# Altium schematic sheet Schematic.SchDoc
size A4; SheetNumber: 1; SheetTotal: 1
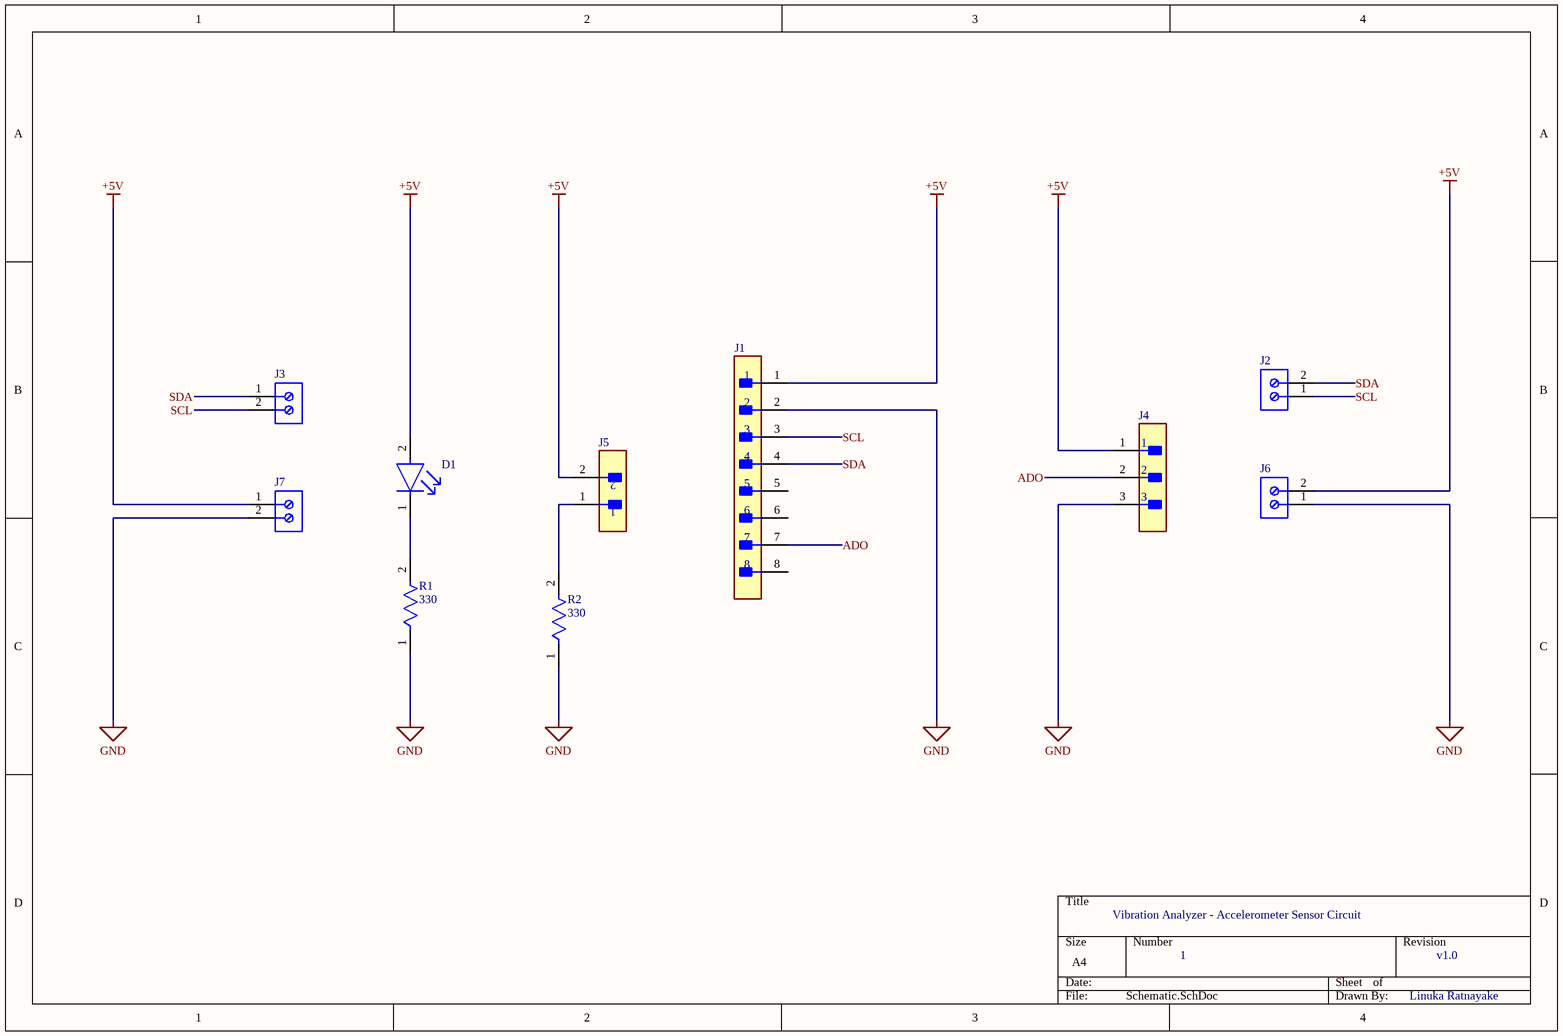
[diagram p0: Schematic.SchDoc]

## Parts
D1  HSMG-C150  [FP-HSMG-C150-MFG]  (value not drawn)
J1  22-29-2081  [FP-22-29-2081-MFG]  (value not drawn)
J2  691214110002  [691214110002]  (value not drawn)
J3  691214110002  [691214110002]  (value not drawn)
J4  90120-0763  [FP-90120-0763-MFG]  (value not drawn)
J5  B2B-XH-A(LF)(SN)  [FP-B2B-XH-A_LF_SN-MFG]  (value not drawn)
J6  691214110002  [691214110002]  (value not drawn)
J7  691214110002  [691214110002]  (value not drawn)
R1  Resistance: 330  [FP-MCR18-IPC_B]  (hidden comment: MCR18EZPF30R0)
R2  Resistance: 330  [FP-MCR18-IPC_B]  (hidden comment: MCR18EZPF30R0)

## Nets
+5V: D1.2(A) J1.1 J4.1 J5.2 J6.2 J7.1
GND: J1.2 J4.3 J6.1 J7.2 R1.1 R2.1
ADO: J1.7 J4.2
SCL: J1.3 J2.1 J3.2
SDA: J1.4 J2.2 J3.1
NetD1_1: D1.1(C) R1.2
NetJ5_1: J5.1 R2.2

Not connected (* = marked no-connect by the designer): J1 5 6 8

## Notes on the sheet
- Vibration Analyzer - Accelerometer Sensor Circuit
- 1
- v1.0
- Linuka Ratnayake

## Library data of the parts
D1 = CMP-2000-05061-2: LED GREEN DIFFUSED 1206 SMD; Manufacturer: Broadcom; Led Orientation: Top View; Max Junction Temp: +95°C; Peak Emmision Wavelength: 570nm; Viewing Angle: 170°; Wavelength: 572nm; Reverse Voltage: 5V; Luminous Intensity: 15mcd; Forward Voltage: 2.2V; Power Dissipation: 65mW; Forward Current: 20mA; ComponentLink2Description: Datasheet; Lead Free: Yes; Temperature Range Low: -40°C; Package: HSMG-C150; Digikey Description: LED GREEN DIFFUSED 1206 SMD; Mouser Description: LED Uni-Color Green 570nm 2-Pin Chip LED T/R; Manufacturer Part Number: HSMG-C150; Temperature Range High: +85°C; Device Class L1: Optoelectronics; Colour: Green; Category: Diode; Device Class L3: unset; RoHS: TRUE; Height: 1.2mm; ComponentLink2URL: https://docs.broadcom.com/docs/AV02-0551EN; Device Class L2: LEDs; Automotive: No; Ipc Land Pattern Name: DIOCP320160X55; Octopart: https://octopart.com/hsmg-c150-broadcom-71131304; Temperature: -40°C to +85°C
J1 = CMP-00257-00277737-1: 22-29-2081 KK® 254 Wire-to-Board Header, Vertical, with Friction Lock, 8 Circuits, Gold (Au) Plating; NexarPartId: 277737; Contact Resistance: 10mΩ; Voltage Rating: 250V; Number of Positions: 8; Pitch: 2.54mm; Insulation Resistance: 50GΩ; Glow Wire Compliant: Non-compliant; Gender: Male; Current Rating: 4A; Number of Pins: 8; Lead Free: Lead Free; Color: White; Flammability Rating: UL94 V-0; REACH SVHC: Unknown; Height: 11.42mm; Housing Material: Nylon; Contact Plating: Gold; Packaging: Bulk; Min Operating Temperature: -40°C; Number of Contacts: 8; Voltage Rating (DC): 250V; Termination: Through Hole; Number of Rows: 1; Halogen Free: Low Halogen; Contact Material: Brass; Radiation Hardening: No; Max Operating Temperature: 75°C; Orientation: Vertical; Mount: Through Hole; Schedule B: 8536694040; Number of Circuits: 8; RoHS: Compliant; Lead Pitch: 2.54mm
J2 J3 J6 J7 = CMP-1502-02464-2: NexarPartId: 18818288; Plating: Brass, Steel; Current: 10A; Pitch: 3.5052mm; Number of Levels: 1; Number of Contacts: 2; Wire Gauge (Min): 16AWG; Voltage: 300V; Wire Gauge (Max): 24AWG; Stripping Length: -6mm; Number of Pins: 2; Number of Rows: 1; REACH SVHC: Unknown; RoHS: Compliant; Housing Material: Nylon; Termination: Screw; Mount: Through Hole; Contact Plating: Brass, Tin; Number of Positions Per Level: 2; Color: Blue, Green; Width: 7.9mm; Voltage Rating: 300V; Length: 7.4mm; Current Rating: 10A; Wire/Cable Gauge: 24AWG; Packaging: Box; Max Operating Temperature: 105°C; Lead Pitch: 3.5mm; Height: 8.7mm; Contact Material: Brass; Min Operating Temperature: -40°C
J4 = CMP-04776-000084-1: CONN HEADER VERT 3POS 2.54MM; Manufacturer: Molex; Voltage Rating: 350V; Number Of Contacts: 3; Conn Orientation: Vertical; Current Rating: 3A; Conn Gender: Male; Description: Board-To-Board Connector, C-Grid III 90120 Series, Through Hole, Header, 3, 2.54 mm; Package: 90120-0763; ComponentLink2Description: Datasheet; Height: 5.8mm; Manufacturer Part Number: 90120-0763; Temperature Range High: +125°C; RoHS: TRUE; ComponentLink2URL: https://www.molex.com/webdocs/datasheets/pdf/en-us/0901200763_PCB_HEADERS.pdf; Device Class L2: Headers and Wire Housings; Temperature: -55°C to +125°C; Device Class L1: Connectors; Pitch: 2.54mm; Footprint Url: https://www.molex.com/pdm_docs/sd/901200763_sd.pdf; Device Class L3: unset; Temperature Range Low: -55°C; Number Of Rows: 1; Category: Conn; Lead Free: Yes; Mouser Description: Board-To-Board Connector, C-Grid III 90120 Series, Through Hole, Header, 3, 2.54 mm; Octopart: https://octopart.com/90120-0763-molex-655433; Contact Material: Gold,Nickel; Automotive: No; Digikey Description: CONN HEADER VERT 3POS 2.54MM
J5 = CMP-2000-05888-3: CONN HEADER VERT 2POS 2.5MM; Current Rating: 3A; Voltage Rating: 250V; Number of Contacts: 2; Contact Resistance: 20mR; Wire/Cable Gauge: 22AWG; Insulation Resistance: 1GR; Connector Type: Male Pin; Packaging: Bulk; Contact Material: Brass; Lead Free: Lead Free; Orientation: Straight; Contact Plating: Tin; Max Current Rating: 3A; Termination: Solder; Fastening Type: Detent; Depth: 5.75mm; Housing Material: Polyamide; REACH SVHC: No SVHC; Series: XH; Voltage Rating (AC): 250V; Number of Positions: 2; Color: Natural; Contact Type: Male Pin; Max Voltage Rating (DC): 250V; Pitch: 2.5mm; Lead Pitch: 2.5mm; Mount: Through Hole; Max Operating Temperature: 85°C; Length: 7.4mm; Max Voltage Rating (AC): 250V; Min Operating Temperature: -25°C; Number of Rows: 1; Housing Color: White
R1 R2 = CMP-08839-012195-1: Thick Film Chip Resistor, 1206, 30Ω, 1%, 100ppm/°C, 0.25W, 200V; Max Power Dissipation: 250mW; Case Code (Imperial): 1206; Case Code (Metric): 3216; Resistor Type: Thick Film; Tolerance: 1%; Package Quantity: 5000; Height: 0.026inch; RoHS Compliant: Yes; Series: MCR18; Number of Terminations: 2; Lead Free: Lead Free; Width: 0.063inch; Length: 0.126inch; Case/Package: 1206; Packaging: Tape and Reel; Features: Automotive AEC-Q200; Voltage Rating (DC): 200V; Temperature Coefficient: 100ppm/°C